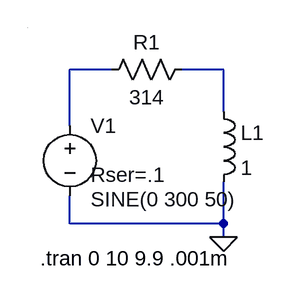
[diagram p0: schematic Draft5.asc]
Draft5.asc, the LTspice schematic file:
Version 4
SHEET 1 880 680
WIRE 96 48 48 48
WIRE 224 48 176 48
WIRE 224 96 224 48
WIRE 48 112 48 48
WIRE 48 224 48 192
WIRE 224 224 224 176
WIRE 224 224 48 224
WIRE 224 240 224 224
WIRE 0 0 0 0
FLAG 224 240 0
SYMBOL ind 208 80 R0
SYMATTR InstName L1
SYMATTR Value 1
SYMBOL voltage 48 96 R0
WINDOW 3 24 100 Left 2
WINDOW 123 0 0 Left 0
WINDOW 39 24 72 Left 2
SYMATTR InstName V1
SYMATTR Value SINE(0 300 50)
SYMATTR SpiceLine Rser=.1
SYMBOL res 192 32 R90
WINDOW 0 0 56 VBottom 2
WINDOW 3 32 56 VTop 2
SYMATTR InstName R1
SYMATTR Value 314
TEXT 14 264 Left 2 !.tran 0 10 9.9 .001m

The netlist it stands for:
* Draft5.asc
L1 N002 0 1
V1 N001 0 SINE(0 300 50) Rser=.1
R1 N002 N001 314
.tran 0 10 9.9 .001m
.backanno
.end